# EAGLE design console v3 (EAGLE 7.2.0)
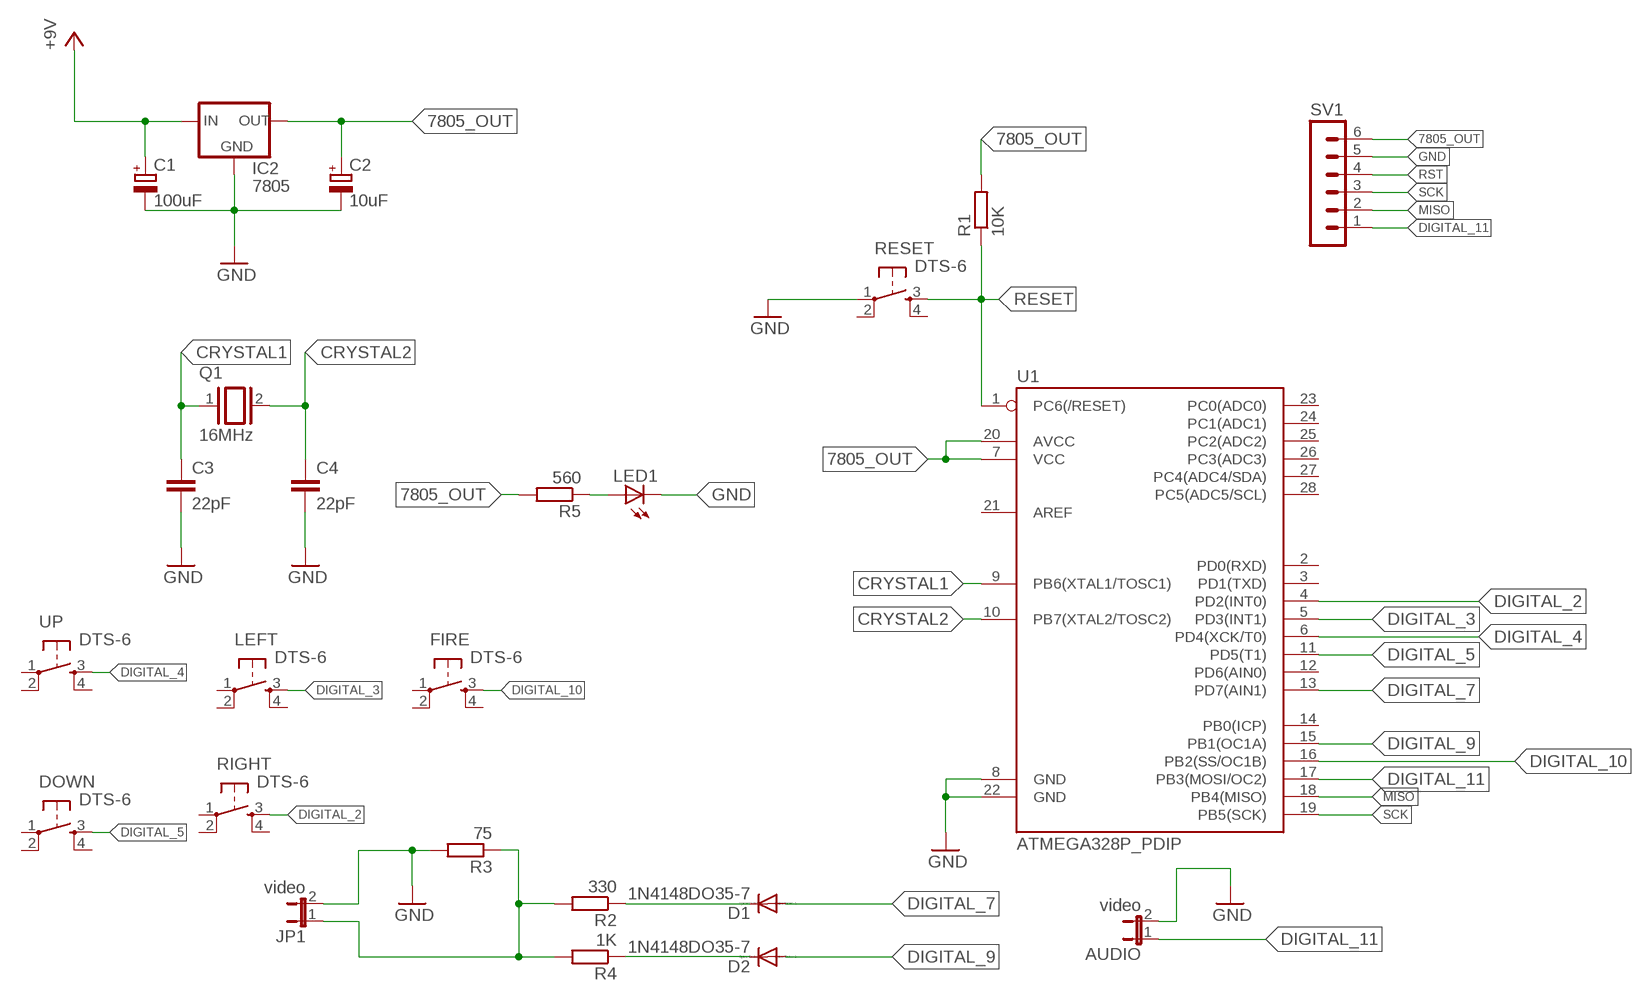
[diagram p0: schematic, sheet 1]

## Parts
AUDIO  video  JP1E  [JP1]
C1  100uF  CPOL-EUE2,5-6E  [E2,5-6E]
C2  10uF  CPOL-EUE2,5-6E  [E2,5-6E]
C3  22pF  C2,5-3  [C2.5-3]
C4  22pF  C2,5-3  [C2.5-3]
D1  1N4148DO35-7  [DO35-7]
D2  1N4148DO35-7  [DO35-7]
DOWN  DTS-6  [DTS-6]
FIRE  DTS-6  [DTS-6]
IC2  7805  78MXXL  [78MXXL]
JP1  video  JP1E  [JP1]
LED1  LED3MM  [LED3MM]
LEFT  DTS-6  [DTS-6]
Q1  16MHz  XTAL/S  [QS]
R1  10K  R-EU_0204/5  [0204/5]
R2  330  R-EU_0204/5  [0204/5]
R3  75  R-EU_0204/5  [0204/5]
R4  1K  R-EU_0204/5  [0204/5]
R5  560  R-EU_0204/5  [0204/5]
RESET  DTS-6  [DTS-6]
RIGHT  DTS-6  [DTS-6]
SV1  MA06-1  [MA06-1]
U1  ATMEGA328P_PDIP  [DIL28-3]
UP  DTS-6  [DTS-6]

## Nets
7805_OUT: C2.+ IC2.OUT R1.2 R5.2 SV1.6 U1.7(VCC) U1.20(AVCC)
CRYSTAL1: C3.1 Q1.1 U1.9(PB6(XTAL1/TOSC1))
CRYSTAL2: C4.1 Q1.2 U1.10(PB7(XTAL2/TOSC2))
DIGITAL_2: RIGHT.3 U1.4(PD2(INT0))
DIGITAL_3: LEFT.3 U1.5(PD3(INT1))
DIGITAL_4: U1.6(PD4(XCK/T0)) UP.3
DIGITAL_5: DOWN.3 U1.11(PD5(T1))
DIGITAL_7: D1.A U1.13(PD7(AIN1))
DIGITAL_9: D2.A U1.15(PB1(OC1A))
DIGITAL_10: FIRE.3 U1.16(PB2(SS/OC1B))
DIGITAL_11: AUDIO.1 SV1.1 U1.17(PB3(MOSI/OC2))
GND: AUDIO.2 C1.- C2.- C3.2 C4.2 IC2.GND JP1.2 LED1.K(C) R3.2 RESET.1 SV1.5 U1.8(GND) U1.22(GND)
MISO: SV1.2 U1.18(PB4(MISO))
N$1: LED1.A R5.1
N$2: D1.C R2.1
N$3: D2.C R4.1
N$4: JP1.1 R2.2 R3.1 R4.2
RESET: R1.1 RESET.3 U1.1(PC6(/RESET))
RST: SV1.4
SCK: SV1.3 U1.19(PB5(SCK))
VCC: C1.+ IC2.IN ; supply symbol labelled +9V
Unconnected: DOWN.1 DOWN.2 DOWN.4 FIRE.1 FIRE.2 FIRE.4 LEFT.1 LEFT.2 LEFT.4 RESET.2 RESET.4 RIGHT.1 RIGHT.2 RIGHT.4 U1.2(PD0(RXD)) U1.3(PD1(TXD)) U1.12(PD6(AIN0)) U1.14(PB0(ICP)) U1.21(AREF) U1.23(PC0(ADC0)) U1.24(PC1(ADC1)) U1.25(PC2(ADC2)) U1.26(PC3(ADC3)) U1.27(PC4(ADC4/SDA)) U1.28(PC5(ADC5/SCL)) UP.1 UP.2 UP.4

## Library data of the parts
AUDIO JP1 = jumper:JP1E: JUMPER
C1 C2 = rcl:CPOL-EU: POLARIZED CAPACITOR, European symbol
C3 C4 = capacitor-wima:C: CAPACITOR naming: grid - package width
D1 D2 = diode:1N4148: DIODE high speed (Philips)
DOWN FIRE LEFT RESET RIGHT UP = switch-tact:DTS-6
IC2 = v-reg:78MXXL: VOLTAGE REGULATOR
LED1 = led:LED: LED OSRAM: - CHIPLED LG R971, LG N971, LY N971, LG Q971, LY Q971, LO R971, LY R971 LH N974, LH R974 LS Q976, LO Q976, LY Q976 LO Q996 - Hyper CHIPLED LW Q18S LB Q993, LB Q99A, LB R99A - SideLED LS A670, LO A670, LY A670, LG A670, LP A670 LB A673, LV A673, LT A673, LW A673 LH A674 LY A675 LS A676, LA A676, LO A676, LY A676, LW A676 LS A679, LY A679, LG A679 - Hyper Micro SIDELED® LS Y876, LA Y876, LO Y876, LY Y876 LT Y87S - SmartLED LW L88C, LW L88S LB L89C, LB L89S, LG L890 LS L89K, LO L89K, LY L89K LS L896, LA L896, LO L896, LY L896 - TOPLED LS T670, LO T670, LY T670, LG T670, LP T670 LSG T670, LSP T670, LSY T670, LOP T670, LYG T670 LG T671, LOG T671, LSG T671 LB T673, LV T673, LT T673, LW T673 LH T674 LS T676, LA T676, LO T676, LY T676, LB T676, LH T676, LSB T676, LW T676 LB T67C, LV T67C, LT T67C, LS T67K, LO T67K, LY T67K, LW E67C LS E67B, LA E67B, LO E67B, LY E67B, LB E67C, LV E67C, LT E67C LW T67C LS T679, LY T679, LG T679 LS T770, LO T770, LY T770, LG T770, LP T770 LB T773, LV T773, LT T773, LW T773 LH T774 LS E675, LA E675, LY E675, LS T675 LS T776, LA T776, LO T776, LY T776, LB T776 LHGB T686 LT T68C, LB T68C - Hyper Mini TOPLED® LB M676 - Mini TOPLED Santana® LG M470 LS M47K, LO M47K, LY M47K Source: http://www.osram.convergy.de LUXEON: - LUMILED® LXK2-PW12-R00, LXK2-PW12-S00, LXK2-PW14-U00, LXK2-PW14-V00 LXK2-PM12-R00, LXK2-PM12-S00, LXK2-PM14-U00 LXK2-PE12-Q00, LXK2-PE12-R00, LXK2-PE12-S00, LXK2-PE14-T00, LXK2-PE14-U00 LXK2-PB12-K00, LXK2-PB12-L00, LXK2-PB12-M00, LXK2-PB14-N00, LXK2-PB14-P00, LXK2-PB14-Q00 LXK2-PR12-L00, LXK2-PR12-M00, LXK2-PR14-Q00, LXK2-PR14-R00 LXK2-PD12-Q00, LXK2-PD12-R00, LXK2-PD12-S00 LXK2-PH12-R00, LXK2-PH12-S00 LXK2-PL12-P00, LXK2-PL12-Q00, LXK2-PL12-R00 Source: www.luxeon.com KINGBRIGHT: KA-3528ASYC Source: www.kingbright.com
Q1 = special:XTAL/S: CRYSTAL
R1-R5 = resistor:R-EU_: RESISTOR, European symbol
SV1 = con-lstb:MA06-1: PIN HEADER; OC_FARNELL: unknown; OC_NEWARK: unknown
U1 = SparkFun-DigitalIC:ATMEGA328P_PDIP: uC used in the Arduino 32kb flash, 1k EEPROM, 2k SRAM This is the through-hole version of this chip.

## Board
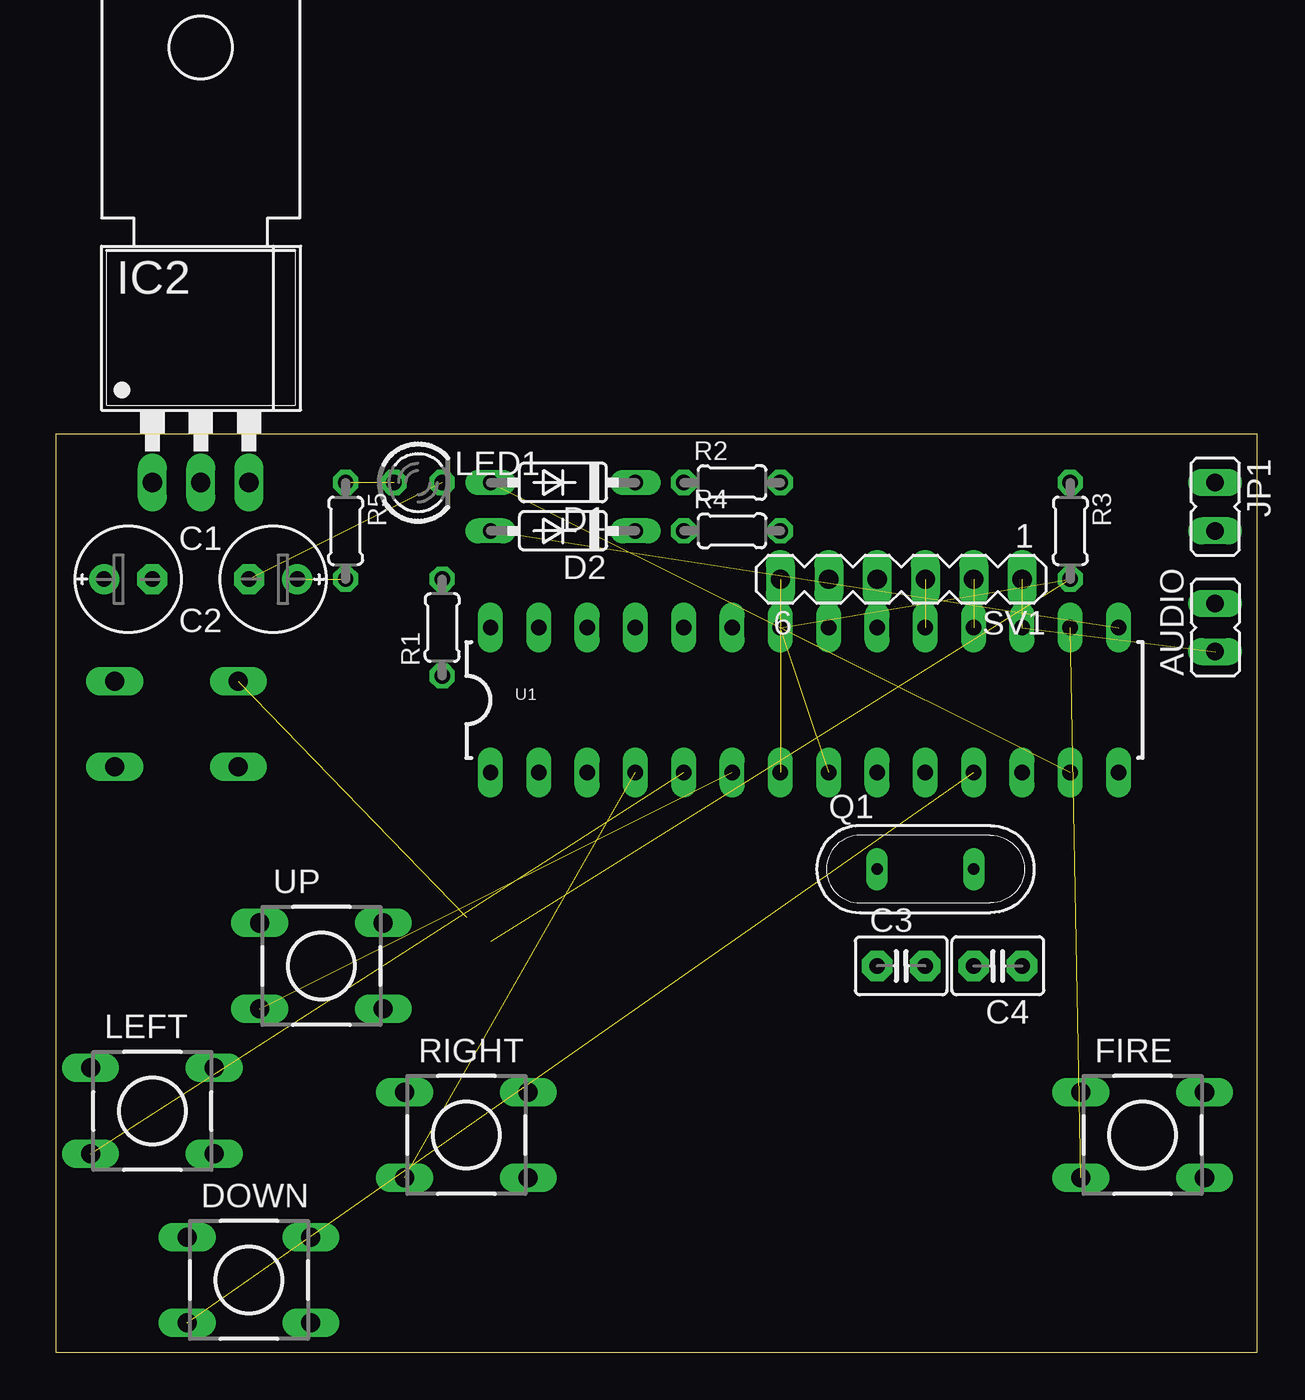
[diagram p1: board, top side]
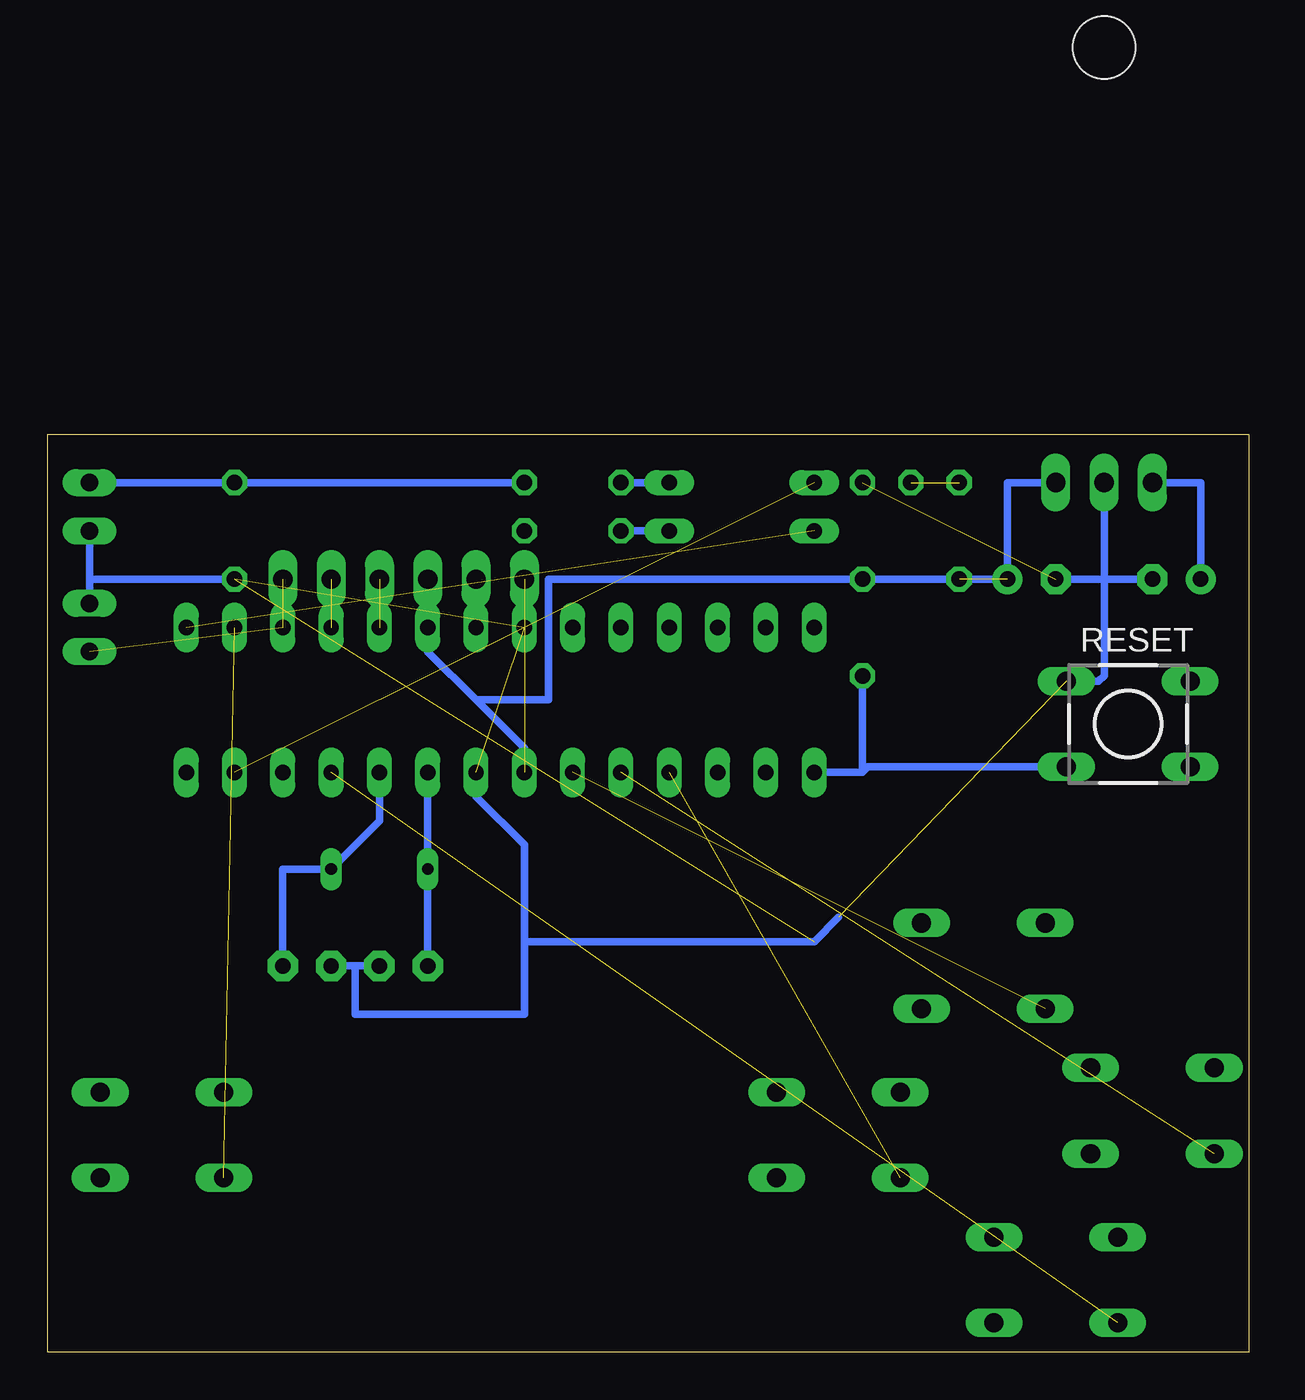
[diagram p2: board, bottom side, seen from below]

Size 63.17 x 48.25 mm. Coordinates in mm from the lower left corner, seen from the top.
Outline: 0,0 63.17,0 63.17,48.25 0,48.25 0,0
Copper layers (1*16): Top 0.035mm / dielectric 1.5mm / Bottom 0.035mm
Design rules "default": minimum track width 10mil, minimum drill 24mil, track to track 8mil, track to pad 8mil, pad to pad 8mil, via to via 8mil, smd to smd 8mil, copper to edge 40mil, drill to drill 8mil, minimum pad ring 10mil, minimum via ring 8mil, stop-mask expansion 4mil, vias tented up to drill 0mil, thermal gap 10mil

### Footprints (pad centres in the part's own frame; a part is rotated, then mirrored left to right if it is on the bottom)
JP1 = drill 0.914 long: 1 0,-1.27; 2 0,1.27
E2,5-6E = drill 0.813 pad 1.575: + -1.27,0 | drill 0.813 pad 1.575 octagon: - 1.27,0
C2.5-3 = drill 0.813 pad 1.6 octagon: 1 -1.27,0; 2 1.27,0
DO35-7 = drill 0.813 long: A 3.81,0; C -3.81,0
DTS-6 = drill 1 long: 1 -3.25,2.25; 2 3.25,2.25; 3 -3.25,-2.25; 4 3.25,-2.25
78MXXL = drill 1.016 long: GND 0,-5.08; IN -2.54,-5.08; OUT 2.54,-5.08 | hole 3.302: 0,17.78
LED3MM = drill 0.813 octagon: A -1.27,0; K 1.27,0
QS = drill 0.61 long: 1 -2.54,0; 2 2.54,0
0204/5 = drill 0.813 octagon: 1 -2.54,0; 2 2.54,0
MA06-1 = drill 1.016 long: 1 -6.35,0; 2 -3.81,0; 3 -1.27,0; 4 1.27,0; 5 3.81,0; 6 6.35,0
DIL28-3 = drill 0.813 long: 1 -16.51,-3.81; 2 -13.97,-3.81; 3 -11.43,-3.81; 4 -8.89,-3.81; 5 -6.35,-3.81; 6 -3.81,-3.81; 7 -1.27,-3.81; 8 1.27,-3.81; 9 3.81,-3.81; 10 6.35,-3.81; 11 8.89,-3.81; 12 11.43,-3.81; 13 13.97,-3.81; 14 16.51,-3.81; 15 16.51,3.81; 16 13.97,3.81; 17 11.43,3.81; 18 8.89,3.81; 19 6.35,3.81; 20 3.81,3.81; 21 1.27,3.81; 22 -1.27,3.81; 23 -3.81,3.81; 24 -6.35,3.81; 25 -8.89,3.81; 26 -11.43,3.81; 27 -13.97,3.81; 28 -16.51,3.81

### Placement (x,y rotation side)
AUDIO  60.96,38.1 0 top
C1  3.81,40.64 0 top
C2  11.43,40.64 180 top
C3  44.45,20.32 0 top
C4  49.53,20.32 180 top
D1  26.67,45.72 180 top
D2  26.67,43.18 180 top
DOWN  10.16,3.81 0 top
FIRE  57.15,11.43 0 top
IC2  7.62,50.8 0 top
JP1  60.96,44.45 180 top
LED1  19.05,45.72 0 top
LEFT  5.08,12.7 0 top
Q1  45.72,25.4 0 top
R1  20.32,38.1 90 top
R2  35.56,45.72 0 top
R3  53.34,43.18 270 top
R4  35.56,43.18 0 top
R5  15.24,43.18 270 top
RESET  6.35,33.02 0 bottom
RIGHT  21.59,11.43 0 top
SV1  44.45,40.64 180 top
U1  39.37,34.29 0 top
UP  13.97,20.32 0 top

### Tracks (layer width: path | path; a pad name or v marks a point on that pad's centre or on a via)
7805_OUT  (2 unrouted)
  Bottom 0.406: IC2.OUT 12.7,45.72 C2.+ R1.2 36.83,40.64 36.83,34.29 40.64,34.29 | U1.20 43.18,36.83 40.64,34.29 | 40.64,34.29 38.1,31.75 U1.7
CRYSTAL1
  Bottom 0.406: U1.9 Q1.1 C3.1
CRYSTAL2
  Bottom 0.406: U1.10 45.72,27.94 Q1.2 50.8,25.4 C4.1
DIGITAL_2  (1 unrouted)
DIGITAL_3  (1 unrouted)
DIGITAL_4  (1 unrouted)
DIGITAL_5  (1 unrouted)
DIGITAL_7  (1 unrouted)
DIGITAL_9  (1 unrouted)
DIGITAL_10  (1 unrouted)
DIGITAL_11  (2 unrouted)
GND  (5 unrouted)
  Bottom 0.406: JP1.2 60.96,40.64 | 60.96,40.64 AUDIO.2 | R3.2 60.96,40.64 | C1.- 7.62,40.64 | 7.62,40.64 C2.- | IC2.GND 7.62,40.64 | RESET.1 7.91,35.27 7.62,35.56 7.62,40.64 | C4.2 46.99,20.32 | 46.99,20.32 C3.2 | 38.1,21.59 38.1,17.78 46.99,17.78 46.99,20.32 | 21.59,22.86 22.86,21.59 38.1,21.59 | U1.8 40.64,29.21 38.1,26.67 38.1,21.59
MISO  (1 unrouted)
N$1  (1 unrouted)
N$2
  Bottom 0.406: R2.1 D1.C
N$3
  Bottom 0.406: R4.1 D2.C
N$4
  Bottom 0.406: JP1.1 R3.1 R2.2
RESET
  Bottom 0.406: R1.1 20.32,30.48 | 20.32,30.48 U1.1 | RESET.3 20.03,30.77 20.32,30.48
SCK  (1 unrouted)
VCC
  Bottom 0.406: C1.+ 2.54,45.72 IC2.IN